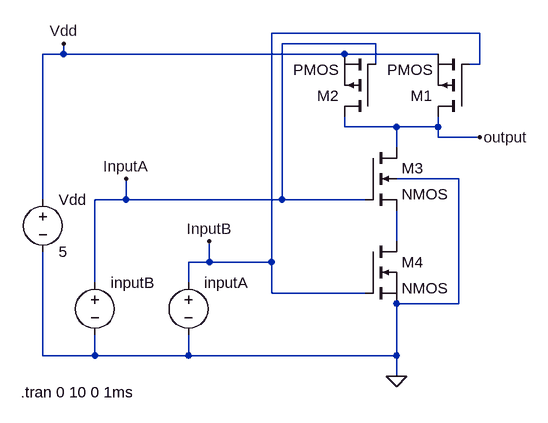
[diagram p0: schematic NandGate.asc]
NandGate.asc, the LTspice schematic file:
Version 4
SHEET 1 880 680
WIRE 272 -80 -48 -80
WIRE 112 -64 -32 -64
WIRE -368 -48 -368 -64
WIRE -368 -48 -400 -48
WIRE 64 -48 -368 -48
WIRE 208 -48 64 -48
WIRE 112 -32 112 -64
WIRE 272 -32 272 -80
WIRE 272 -32 256 -32
WIRE 64 64 64 48
WIRE 144 64 64 64
WIRE 208 64 208 48
WIRE 208 64 144 64
WIRE 208 80 208 64
WIRE 272 80 208 80
WIRE 144 96 144 64
WIRE 240 144 144 144
WIRE -400 176 -400 -48
WIRE -272 176 -272 144
WIRE -272 176 -320 176
WIRE -32 176 -32 -64
WIRE -32 176 -272 176
WIRE 96 176 -32 176
WIRE 144 240 144 192
WIRE -144 272 -144 240
WIRE -144 272 -176 272
WIRE -48 272 -48 -80
WIRE -48 272 -144 272
WIRE -320 304 -320 176
WIRE -176 304 -176 272
WIRE -48 320 -48 272
WIRE 96 320 -48 320
WIRE 240 336 240 144
WIRE 240 336 144 336
WIRE -400 416 -400 256
WIRE -320 416 -320 384
WIRE -320 416 -400 416
WIRE -176 416 -176 384
WIRE -176 416 -320 416
WIRE 144 416 144 336
WIRE 144 416 -176 416
WIRE 144 448 144 416
FLAG 144 448 0
FLAG -368 -64 Vdd
FLAG -272 144 InputA
FLAG -144 240 InputB
FLAG 272 80 output
SYMBOL voltage -320 288 R0
WINDOW 123 0 0 Left 2
WINDOW 39 0 0 Left 2
WINDOW 3 24 96 Invisible 2
SYMATTR InstName inputB
SYMATTR Value PULSE(0 5 0 0 0 2 4)
SYMBOL voltage -400 160 R0
WINDOW 123 0 0 Left 2
WINDOW 39 0 0 Left 2
SYMATTR InstName Vdd
SYMATTR Value 5
SYMBOL pmos 256 48 R180
SYMATTR InstName M1
SYMBOL pmos 112 48 R180
SYMATTR InstName M2
SYMBOL nmos 96 240 R0
SYMATTR InstName M4
SYMBOL nmos4 96 96 R0
SYMATTR InstName M3
SYMBOL voltage -176 288 R0
WINDOW 123 0 0 Left 2
WINDOW 39 0 0 Left 2
WINDOW 3 24 96 Invisible 2
SYMATTR InstName inputA
SYMATTR Value PULSE(0 5 0 0 0 1 2)
TEXT -434 472 Left 2 !.tran 0 10 0 1ms

The netlist it stands for:
* NandGate.asc
V§inputB InputA 0 PULSE(0 5 0 0 0 2 4)
Vdd Vdd 0 5
M1 output InputB Vdd Vdd PMOS
M2 output InputA Vdd Vdd PMOS
M4 N001 InputB 0 0 NMOS
M3 output InputA N001 0 NMOS
V§inputA InputB 0 PULSE(0 5 0 0 0 1 2)
.model NMOS NMOS
.model PMOS PMOS
.lib standard.mos
.tran 0 10 0 1ms
.backanno
.end